# EAGLE design droracer (EAGLE 9.6.2)
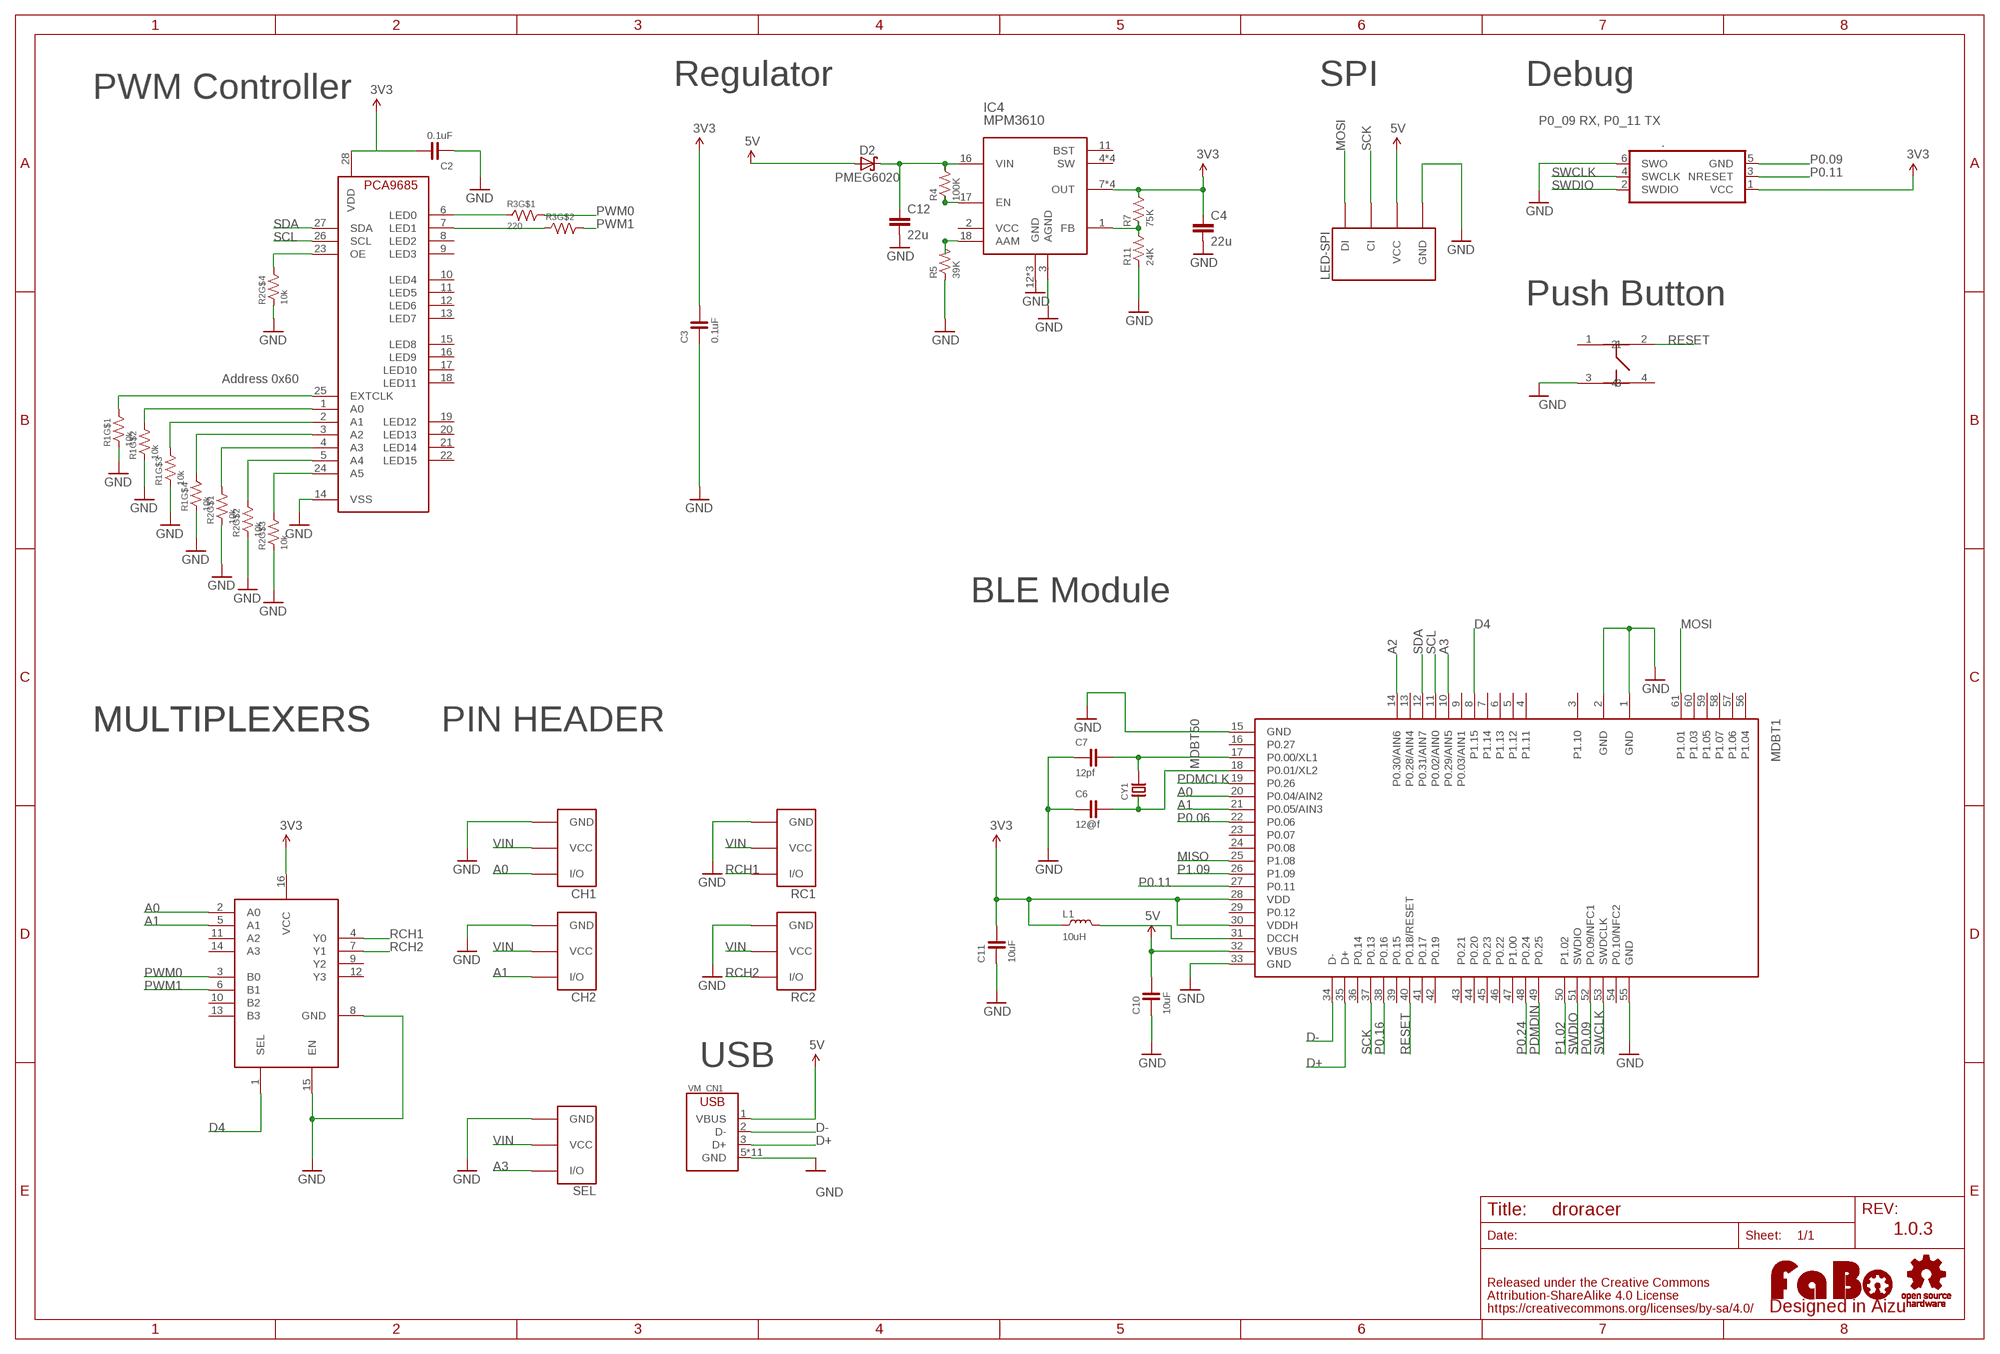
[diagram p0: schematic, sheet 1]

## Parts
.  TC2030-IDC-NL  [TC2030-IDC-NL]
C2  0.1uF  CAPACITOR-0603  [0603]
C3  0.1uF  CAPACITOR-0603  [0603]
C4  22u  C-22U-0805  [0805-R2013X50N]
C6  12@f  CAPACITOR-0603  [0603]
C7  12pf  CAPACITOR-0603  [0603]
C10  10uF  CAPACITOR-0603  [0603]
C11  10uF  CAPACITOR-0603  [0603]
C12  22u  C-22U-0805  [0805-R2013X50N]
CH1  FABO_BRICK_3PIN-HEADER  [FABO_BRICK_3PIN_HEADER]
CH2  FABO_BRICK_3PIN-HEADER  [FABO_BRICK_3PIN_HEADER]
CY1  CRYSTAL-ABS07  [ABRACON-ABS07-32.768KHZ]
D2  PMEG6020  PMEG6020AELRX  [SODFL3517X110N]
IC3  MULTIPLEXERSMC74HC157A  [TSSOP-16]
IC4  MPM3610  [MPM3610]
L1  10uH  COIL-0603  [0603]
LED-SPI  FABO-SPI-LED-B04B  [SPI-B04B-PASK-1]
MDBT1  MDBT50  [MDBT50]
R1  10k  RESISTOR_ARRAY  [EXBV8V]
R2  10k  RESISTOR_ARRAY  [EXBV8V]
R3  220  RESISTOR_ARRAY  [EXBV8V]
R4  100K  RESISTOR-0603  [0603]
R5  39K  RESISTOR-0603  [0603]
R7  75K  RESISTOR-0603  [0603]
R11  24K  RESISTOR-0603  [0603]
RC1  FABO_BRICK_3PIN-HEADER  [FABO_BRICK_3PIN_HEADER]
RC2  FABO_BRICK_3PIN-HEADER  [FABO_BRICK_3PIN_HEADER]
SEL  FABO_BRICK_3PIN-HEADER  [FABO_BRICK_3PIN_HEADER]
U$2  PCA9685  [PCA9685]
U$3  LOGO_OSHW-M_BOTTOM  [LOGO_OSHW_M_BOTTOM]
U$4  LOGO_FABO-M  [LOGO_FABO_MS]
U$5  SWICTH-4P(KMR2)  [SWITCH-4P(KMR2)]
VM_CN1  USB-ZX62D  [ZX62D-B-5PA8]

## Nets
3V3: ..1(VCC) C2.2 C3.2 C4.1 C11.2 IC3.16(VCC) IC4.7(OUT) IC4.8(OUT) IC4.9(OUT) IC4.20(OUT) L1.1 MDBT1.28(VDD) MDBT1.30(VDDH) R7.2 U$2.28(VDD)
5V: C10.2 D2.A LED-SPI.VCC MDBT1.32(VBUS) VM_CN1.1(VBUS)
A0: CH1.I/O IC3.2(A0) MDBT1.20(P0.04/AIN2)
A1: CH2.I/O IC3.5(A1) MDBT1.21(P0.05/AIN3)
A2: MDBT1.14(P0.30/AIN6)
A3: MDBT1.10(P0.29/AIN5) SEL.I/O
D4: IC3.1(SEL) MDBT1.8(P1.15)
D+: MDBT1.35(D+) VM_CN1.3(D+)
D-: MDBT1.34(D-) VM_CN1.2(D-)
FB: IC4.1(FB) R7.1 R11.2
GND: ..6(SWO) C2.1 C3.1 C4.2 C6.1 C7.1 C10.1 C11.1 C12.2 CH1.GND CH2.GND IC3.8(GND) IC3.15(EN) IC4.3(AGND) IC4.12(GND) IC4.13(GND) IC4.14(GND) LED-SPI.GND MDBT1.1(GND) MDBT1.2(GND) MDBT1.15(GND) MDBT1.33(GND) MDBT1.55(GND) R1.1 R1.2 R1.3 R1.4 R2.1 R2.2 R2.3 R2.4 R5.1 R11.1 RC1.GND RC2.GND SEL.GND U$2.14(VSS) U$5.3 VM_CN1.5(GND) VM_CN1.B1(GND) VM_CN1.B2(GND) VM_CN1.B3(GND) VM_CN1.B4(GND) VM_CN1.T1(GND) VM_CN1.T2(GND) VM_CN1.T3(GND) VM_CN1.T4(GND) VM_CN1.T5(GND) VM_CN1.T6(GND)
MISO: MDBT1.25(P1.08)
MOSI: LED-SPI.DI MDBT1.61(P1.01)
N$2: R3.1 U$2.6(LED0)
N$3: R3.2 U$2.7(LED1)
N$4: IC4.17(EN) R4.1
N$5: C12.1 D2.C IC4.16(VIN) R4.2
N$6: IC4.18(AAM) R5.2
N$7: R2.5 U$2.23(OE)
N$8: R1.8 U$2.25(EXTCLK)
N$9: R1.7 U$2.1(A0)
N$10: R1.6 U$2.2(A1)
N$11: R1.5 U$2.3(A2)
N$12: R2.8 U$2.4(A3)
N$13: R2.7 U$2.5(A4)
N$19: R2.6 U$2.24(A5)
N$20: C7.2 CY1.P$2 MDBT1.17(P0.00/XL1)
N$21: C6.2 CY1.P$1 MDBT1.18(P0.01/XL2)
N$22: L1.2 MDBT1.31(DCCH)
P0.06: MDBT1.22(P0.06)
P0.09: ..5(GND) MDBT1.52(P0.09/NFC1)
P0.11: ..3(NRESET) MDBT1.27(P0.11)
P0.16: MDBT1.38(P0.16)
P0.24: MDBT1.48(P0.24)
P1.02: MDBT1.50(P1.02)
P1.09: MDBT1.26(P1.09)
PDMCLK: MDBT1.19(P0.26)
PDMDIN: MDBT1.49(P0.25)
PWM0: IC3.3(B0) R3.8
PWM1: IC3.6(B1) R3.7
RCH1: IC3.4(Y0) RC1.I/O
RCH2: IC3.7(Y1) RC2.I/O
RESET: MDBT1.40(P0.18/RESET) U$5.2
SCK: LED-SPI.CI MDBT1.37(P0.13)
SCL: MDBT1.11(P0.02/AIN0) U$2.26(SCL)
SDA: MDBT1.12(P0.31/AIN7) U$2.27(SDA)
SWCLK: ..4(SWCLK) MDBT1.53(SWDCLK)
SWDIO: ..2(SWDIO) MDBT1.51(SWDIO)
VIN: CH1.VCC CH2.VCC RC1.VCC RC2.VCC SEL.VCC
Unconnected: IC3.9(Y2) IC3.10(B2) IC3.11(A2) IC3.12(Y3) IC3.13(B3) IC3.14(A3) IC4.2(VCC) IC4.4(SW) IC4.5(SW) IC4.6(SW) IC4.11(BST) IC4.19(SW) MDBT1.3(P1.10) MDBT1.4(P1.11) MDBT1.5(P1.12) MDBT1.6(P1.13) MDBT1.7(P1.14) MDBT1.9(P0.03/AIN1) MDBT1.13(P0.28/AIN4) MDBT1.16(P0.27) MDBT1.23(P0.07) MDBT1.24(P0.08) MDBT1.29(P0.12) MDBT1.36(P0.14) MDBT1.39(P0.15) MDBT1.41(P0.17) MDBT1.42(P0.19) MDBT1.43(P0.21) MDBT1.44(P0.20) MDBT1.45(P0.23) MDBT1.46(P0.22) MDBT1.47(P1.00) MDBT1.54(P0.10/NFC2) MDBT1.56(P1.04) MDBT1.57(P1.06) MDBT1.58(P1.07) MDBT1.59(P1.05) MDBT1.60(P1.03) R3.3 R3.4 R3.5 R3.6 U$2.8(LED2) U$2.9(LED3) U$2.10(LED4) U$2.11(LED5) U$2.12(LED6) U$2.13(LED7) U$2.15(LED8) U$2.16(LED9) U$2.17(LED10) U$2.18(LED11) U$2.19(LED12) U$2.20(LED13) U$2.21(LED14) U$2.22(LED15) U$5.1 U$5.4

## Notes on the sheet
- Regulator | SPI | Debug
- PWM Controller
- P0_09 RX, P0_11 TX
- Push Button
- Address 0x60
- BLE Module
- MULTIPLEXERS | MULTIPLEXERS | PIN HEADER
- USB
- 1.0.3

## Library data of the parts
. = TagConnect:TC2030-IDC: Tag-Connect In Circuit Programming & Debug Cable 6 Pin http://www.tag-connect.com
C2 C3 C6 C7 C10 C11 = FaBo-Capacitor:CAPACITOR: CAPACITOR
C4 C12 = Arduino-rcl:C: SMD Capacitor; CODE-ARDUINO: 2233; DATASHEET: https://media.digikey.com/pdf/Data%20Sheets/Samsung%20PDFs/CL21A226MQCLQNC_character.pdf; DISTRIBUTOR-LINK: https://www.digikey.com/product-detail/en/samsung-electro-mechanics-america-inc/CL21A226MQCLQNC/1276-2412-1-ND/3890498; DISTRIBUTOR-PN: 1276-2412-1-ND; MANUFACTURER: Samsung; MANUFACTURER-PN: CL21A226MQCLQNC; NOTE: -
CH1 CH2 RC1 RC2 SEL = FaBo-Template:FABO_BRICK_3PIN: FaBo Brick 3pin
CY1 = FaBo-Crystal:CRYSTAL
D2 = Arduino-diodes:PMEG6020AELRX: 60 V, 2 A low leakage current Schottky barrier rectifier Datasheet <http://www.nxp.com/documents/data_sheet/PMEG6020AELR.pdf>; CODE-ARDUINO: 2208; DATASHEET: http://www.nxp.com/documents/data_sheet/PMEG6020AELR.pdf; DISTRIBUTOR-LINK: http://www.digikey.com/products/en?keywords=%20568-12710-1-ND; DISTRIBUTOR-PN: 568-12710-1-ND; MANUFACTURER: NXP; MANUFACTURER-PN: PMEG6020AELRX
IC3 = FaBo-Multiplexers:MULTIPLEXERS
IC4 = Arduino-ICs:MPM3610: MPM3610 Step Down Regulator; CODE-ARDUINO: 2093; DATASHEET: https://www.monolithicpower.com/pub/media/document/MPM3610_r1.01.pdf; DISTRIBUTOR-LINK: https://www.digikey.com/product-detail/en/monolithic-power-systems-inc/MPM3610AGQV-P/1589-1249-1-ND/5298336; DISTRIBUTOR-PN: 1589-1249-1-ND; MANUFACTURER: MPS; MANUFACTURER-PN: MPM3610AGQV-P; RESTRICTIONS: NO
L1 = FaBo-Coil:COIL: RESISTOR
LED-SPI = FaBo-Connetor:FABO-SPI-LED
MDBT1 = MDBT50Q_171031:MDBT50: Raytac Corporation MDBT50 Bluetooth Low Energy Module based on Noridc nRF52840 Source: Raytac datasheet
R1-R3 = component:RESISTOR_ARRAY
R4 R5 R7 R11 = FaBo-Resistors:RESISTOR: RESISTOR
U$2 = FaBo-Motor:PCA9685
U$3 = FaBo-Logo:LOGO_OSHW
U$4 = FaBo-Logo:LOGO_FABO
U$5 = gclue-test:SWICTH-4P(KMR2)
VM_CN1 = component:USB

## Net classes
2 gnd: width 0.254 mm, drill 0.61 mm, clearance 0.254 mm
3 usbvcc: width 0.254 mm, drill 0.61 mm, clearance 0.254 mm
4 aref: width 0.254 mm, drill 0.61 mm, clearance 0.254 mm

## Board
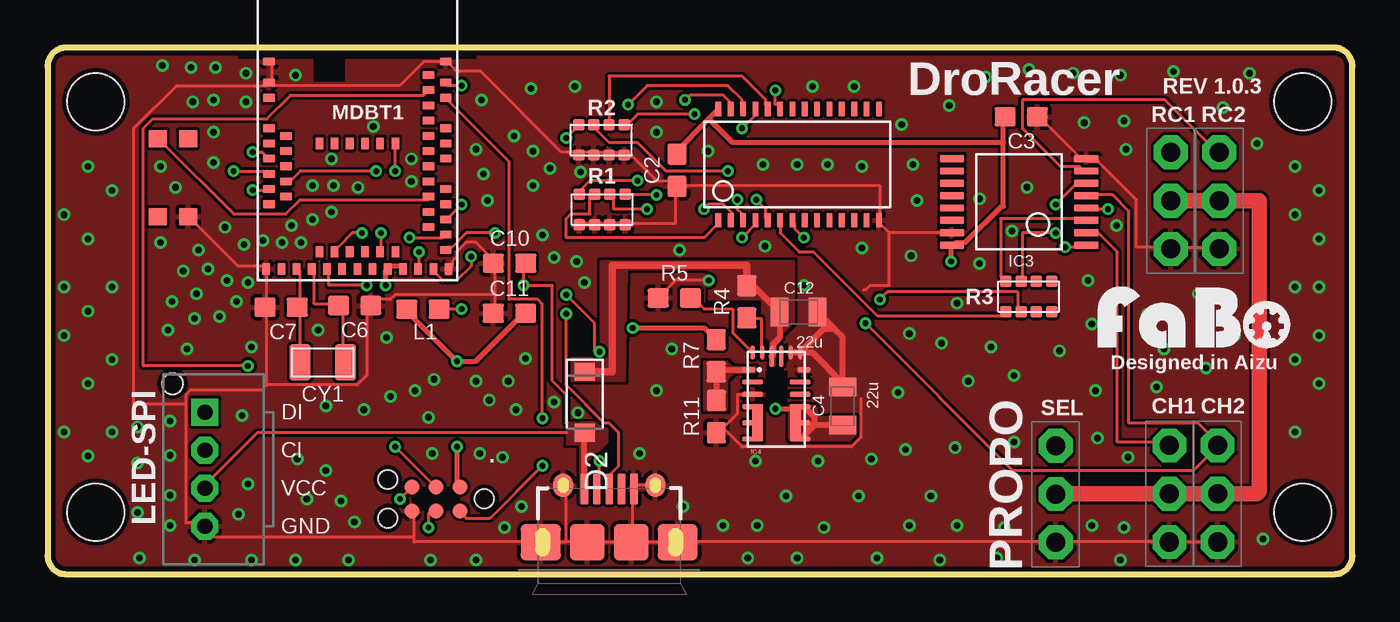
[diagram p1: board, top side]
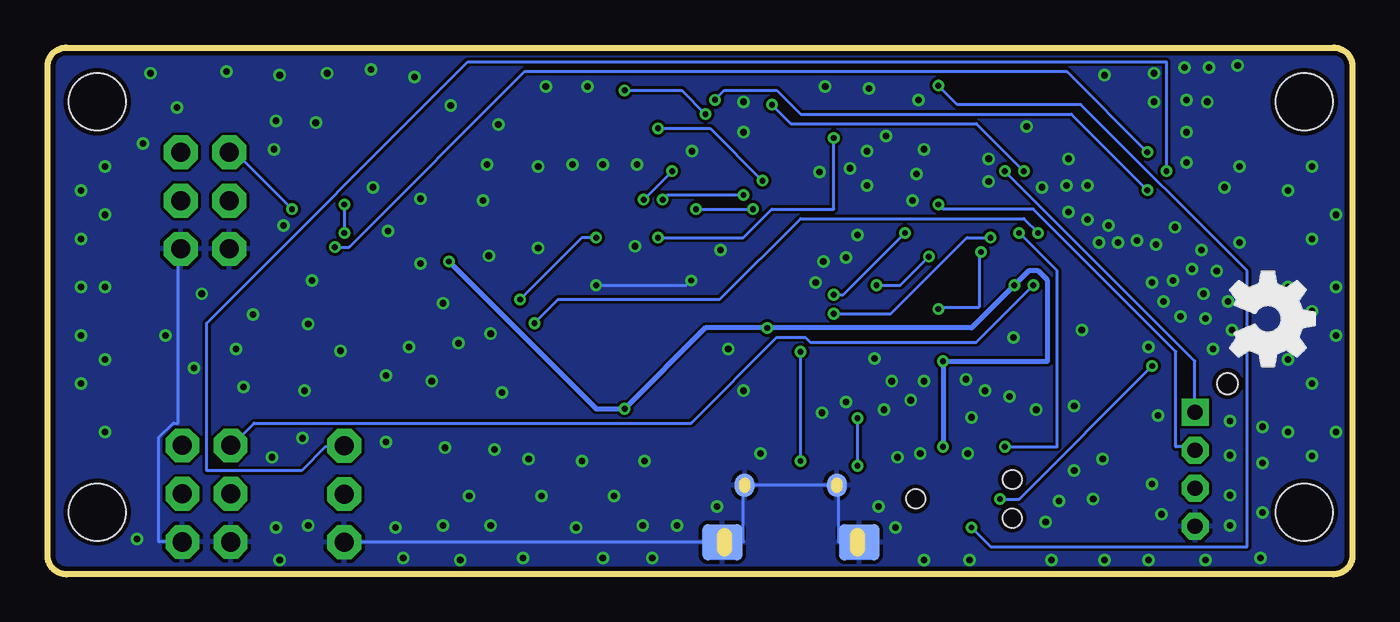
[diagram p2: board, bottom side, seen from below]

Size 68.66 x 27.71 mm. Coordinates in mm from the lower left corner, seen from the top.
Outline: 1,0 67.66,0 arc90 68.66,1 68.66,26.71 arc90 67.66,27.71 1,27.71 arc90 0,26.71 0,1 arc90 1,0
Copper layers (1*16): Top 0.035mm / dielectric 1.6mm / Bottom 0.035mm
Design rules "PCBway": minimum track width 6mil, minimum drill 12mil, track to track 6mil, track to pad 6mil, pad to pad 6mil, via to via 6mil, smd to smd 6mil, copper to edge 10mil, drill to drill 10mil, minimum pad ring 10mil, minimum via ring 6mil, stop-mask expansion 2mil, vias tented up to drill 100mil, thermal gap 8mil
Holes 3 mm at 2.54,24.86 2.54,3.27 66.04,3.27 66.04,24.86

### Footprints (pad centres in the part's own frame; a part is rotated, then mirrored left to right if it is on the bottom)
TC2030-IDC-NL = smd 0.787 x 0.787: 1 -1.27,-0.635; 2 -1.27,0.635; 3 0,-0.635; 4 0,0.635; 5 1.27,-0.635; 6 1.27,0.635 | hole 0.991: -2.54,0; 2.54,1.016; 2.54,-1.016
0603 = smd 1.1 x 1: 1 -0.85,0; 2 0.85,0
0805-R2013X50N = smd 0.95 x 1.45: 1 -1,0; 2 1,0
FABO_BRICK_3PIN_HEADER = drill 1 pad 1.778 octagon: GND -2.54,0; I/O 2.54,0; VCC 0,0
ABRACON-ABS07-32.768KHZ = smd 1.1 x 1.9: P$1 -1.2,0; P$2 1.2,0
SODFL3517X110N = smd 0.91 x 1.07: A 1.605,0; C -1.605,0
TSSOP-16 = smd 0.36 x 1.26: 1 -2.275,-3.53; 2 -1.625,-3.53; 3 -0.975,-3.53; 4 -0.325,-3.53; 5 0.325,-3.53; 6 0.975,-3.53; 7 1.625,-3.53; 8 2.275,-3.53; 9 2.275,3.53; 10 1.625,3.53; 11 0.975,3.53; 12 0.325,3.53; 13 -0.325,3.53; 14 -0.975,3.53; 15 -1.625,3.53; 16 -2.275,3.53
MPM3610 = smd 0.7 x 0.25: 1 -1.45,1.55; 4 -1.45,-0.4; 5 -1.45,-1.25; 6 -1.45,-2.1; 7 1.45,-2.1; 8 1.45,-1.25; 9 1.45,-0.4; 12 1.45,1.55 | smd 1.1 x 0.25: 2 -1.25,0.9; 3 -1.25,0.25; 10 1.25,0.25; 11 1.25,0.9 | smd 0.25 x 0.7: 13 1.25,2.45; 14 0.75,2.45; 17 -0.75,2.45; 18 -1.25,2.45 | smd 0.25 x 1.1: 15 0.25,2.25; 16 -0.25,2.25 | smd 0.6 x 1.95: 19 -1,-1.25; 20 1,-1.25
SPI-B04B-PASK-1 = drill 0.8 pad 1.422 octagon: CI 1,1.27; GND -3,1.27; VCC -1,1.27 | drill 0.8 pad 1.422 square: DI 3,1.27 | hole 1.1: 4.5,2.97
MDBT50 = smd 0.6 x 0.4: 1 -4.65,3.75; 2 -4.65,2.65; 3 -4.65,1.85; 4 -4.65,0.25; 5 -3.75,-0.15; 6 -4.65,-0.55; 7 -3.75,-0.95; 8 -4.65,-1.35; 9 -3.75,-1.75; 10 -4.65,-2.15; 11 -3.75,-2.55; 12 -4.65,-2.95; 13 -3.75,-3.35; 14 -4.65,-3.75; 34 4.65,-6.15; 35 4.65,-5.35; 36 3.75,-4.95; 37 4.65,-4.55; 38 3.75,-4.15; 39 4.65,-3.75; 40 3.75,-3.35; 41 4.65,-2.95; 42 3.75,-2.55; 43 3.75,-1.75; 44 4.65,-1.35; 45 3.75,-0.95; 46 4.65,-0.55; 47 3.75,-0.15; 48 4.65,0.25; 49 3.75,0.65; 50 3.75,1.45; 51 4.65,1.85; 52 3.75,2.25; 53 4.65,2.65; 54 3.75,3.05; 55 4.65,3.75 | smd 0.4 x 0.6: 15 -4.8,-7.15; 16 -4,-7.15; 17 -3.2,-7.15; 18 -2.4,-7.15; 19 -2,-6.25; 20 -1.6,-7.15; 21 -1.2,-6.25; 22 -0.8,-7.15; 23 -0.4,-6.25; 24 0,-7.15; 25 0.4,-6.25; 26 0.8,-7.15; 27 1.2,-6.25; 28 1.6,-7.15; 29 2,-6.25; 30 2.4,-7.15; 31 3.2,-7.15; 32 4,-7.15; 33 4.8,-7.15; 56 -2,-0.55; 57 -1.2,-0.55; 58 -0.4,-0.55; 59 0.4,-0.55; 60 1.2,-0.55; 61 2,-0.55
EXBV8V = smd 0.6 x 0.6: 1 -1.2,-0.8; 2 -0.4,-0.8; 3 0.4,-0.8; 4 1.2,-0.8; 5 1.2,0.8; 6 0.4,0.8; 7 -0.4,0.8; 8 -1.2,0.8
PCA9685 = smd 0.3 x 0.75: 1 -4.15,-2.93; 2 -3.5,-2.93; 3 -2.85,-2.93; 4 -2.2,-2.93; 5 -1.55,-2.93; 6 -0.9,-2.93; 7 -0.25,-2.93; 8 0.4,-2.93; 9 1.05,-2.93; 10 1.7,-2.93; 11 2.35,-2.93; 12 3,-2.93; 13 3.65,-2.93; 14 4.3,-2.93; 15 4.3,2.92; 16 3.65,2.92; 17 3,2.92; 18 2.35,2.92; 19 1.7,2.92; 20 1.05,2.92; 21 0.4,2.92; 22 -0.25,2.92; 23 -0.9,2.92; 24 -1.55,2.92; 25 -2.2,2.92; 26 -2.85,2.92; 27 -3.5,2.92; 28 -4.15,2.92
SWITCH-4P(KMR2) = smd 0.9 x 0.95: 1 -1,0; 2 3.1,0; 3 -1,-1.6; 4 3.1,-1.6
ZX62D-B-5PA8 = smd 0.4 x 1.6: 1 -1.3,4.25; 2 -0.65,4.25; 3 0,4.25; 4 0.65,4.25; 5 1.3,4.25 | smd 1.05 x 1.25 bottom: B1 -2.425,4.45; B2 2.425,4.45 | smd 2.1 x 1.9 bottom: B3 -3.6,1.45; B4 3.6,1.45 | smd 1.05 x 1.25: T1 -2.425,4.45; T2 2.425,4.45 | smd 2.1 x 1.9: T3 -3.6,1.45; T6 3.6,1.45 | smd 1.8 x 1.9: T4 -1.15,1.45; T5 1.15,1.45

### Placement (x,y rotation side)
.  20.44,3.97 180 top
C2  33.12,21.26 90 top
C3  51.23,24.07 180 top
C4  41.83,8.85 90 top
C6  16.16,14.14 180 top
C7  12.29,14.05 0 top
C10  24.31,16.37 0 top
C11  24.3,13.73 0 top
C12  39.52,13.8 0 top
CH1  59.02,4.24 90 top
CH2  61.55,4.24 90 top
CY1  14.48,11.15 180 top
D2  28.27,9.05 270 top
IC3  51.12,19.6 90 top
IC4  38.35,9.22 0 top
L1  19.75,13.95 0 top
LED-SPI  9.55,5.53 90 top
MDBT1  16.3,23.22 0 top
R1  29.19,19.2 0 top
R2  29.14,22.86 0 top
R3  51.62,14.61 0 top
R4  36.79,14.34 90 top
R5  32.98,14.54 0 top
R7  35.18,11.5 90 top
R11  35.19,8.3 90 top
RC1  59.09,19.66 90 top
RC2  61.65,19.66 90 top
SEL  53.04,4.22 90 top
U$2  39.44,21.56 0 top
U$3  4.45,13.43 90 top
U$4  60.32,11.52 0 top
U$5  5.8,19.82 90 top
VM_CN1  29.55,0.24 0 top

### Tracks (layer width: path | path; a pad name or v marks a point on that pad's centre or on a via)
3V3  (via drill 0.3)
  Top 0.152: 35.29,24.46 U$2.28 | 33.04,22.21 C2.2 | 50.29,23.96 C3.2 | 47.79,17.46 IC3.16 47.54,17.21 | 18.04,16.21 MDBT1.28 17.79,15.96 | 18.54,16.21 MDBT1.30 | 21.54,4.71 ..1 | 19.04,13.71 L1.1 | 35.04,12.46 R7.2 | 25.04,13.71 C11.2
  Top 0.254: 33.04,22.21 34.79,23.96 | 34.79,23.96 35.29,24.46 | 50.29,22.71 50.29,19.36 50.19,19.36 48.29,17.46 47.79,17.46 | 50.29,22.71 50.29,23.96 | 34.79,23.96 36.04,22.71 50.29,22.71 | 18.54,16.21 18.04,16.21 | v21.54,6.71 21.54,4.71 | 19.04,13.71 v21.54,11.21 22.54,11.21 25.04,13.71 | v17.79,15.21 17.79,15.96 | 35.04,12.46 34.54,12.96 v30.79,12.96 | v38.29,8.71 39.04,8.71 | v47.54,16.46 47.54,17.21
  Top 0.305: C4.1 40.34,7.85 | 40.34,7.85 39.92,7.85 IC4.8 | IC4.9 40.34,8.28 40.34,7.85 | IC4.7 39.8,7.31 40.34,7.85
  Bottom 0.254: v21.54,6.71 v21.54,11.21 16.04,11.21 16.04,15.46 16.54,15.96 17.04,15.96 v17.79,15.21 20.04,12.96 v30.79,12.96 34.04,12.96 v38.29,8.71 39.79,8.71 v47.54,16.46
  pour Top (no thermals): 39.04,8.86 40.34,8.86 40.44,8.76 40.44,8.26 43.54,8.26 43.64,8.36 43.64,7.06 39.14,7.06 39.04,7.16
5V  (via drill 0.3)
  Top 0.152: v22.29,16.71 22.29,16.21 21.54,15.46 20.79,15.46 20.29,15.96 MDBT1.32 | C10.2 25.04,16.21 v25.04,15.21 26.54,15.21 26.54,10.21 27.29,9.46 27.29,7.96 27.34,7.96 | 27.34,7.46 11.04,7.46 8.29,4.71 LED-SPI.VCC
  Top 0.305: VM_CN1.1 28.25,7.42 D2.A
  Bottom 0.152: v22.29,16.71 23.79,15.21 v25.04,15.21
  pour Top (no thermals): 28.34,5.86 29.44,6.96 29.44,7.96 27.34,7.96 27.34,6.86 28.04,6.86 28.04,3.76 28.34,4.66
A0  (via drill 0.3)
  Top 0.152: v16.79,15.21 14.79,15.21 14.79,15.96 MDBT1.20 | IC3.2 54.79,17.96 55.29,17.96 56.29,16.96 56.29,6.96 58.79,6.96 CH1.I/O
  Bottom 0.152: v16.79,15.21 19.79,12.21 28.54,12.21 28.79,12.46 30.29,12.46 34.79,7.96 57.79,7.96 58.79,6.96 CH1.I/O
A1  (via drill 0.3)
  Top 0.152: v16.54,17.96 16.04,17.96 15.29,17.21 MDBT1.21 | v43.04,13.21 50.79,5.46 60.29,5.46 61.54,6.71 CH2.I/O 61.54,6.96 60.54,7.96 56.89,7.96 56.89,19.11 56.04,19.96 54.79,19.96 IC3.5
  Bottom 0.152: v16.54,17.96 17.29,18.71 29.04,18.71 33.29,14.46 41.79,14.46 v43.04,13.21
A3  (via drill 0.3)
  Top 0.152: v9.79,21.21 11.54,21.21 MDBT1.10
  Bottom 0.152: v9.79,21.21 9.79,26.96 46.54,26.96 60.29,13.21 60.29,5.46 55.29,5.46 54.04,6.71 53.04,6.71 SEL.I/O
D4  (via drill 0.3)
  Top 0.152: v10.79,22.21 11.29,22.21 11.54,21.96 MDBT1.8 | v53.54,17.21 54.54,17.21 IC3.1
  Bottom 0.152: v10.79,22.21 15.04,26.46 43.54,26.46 52.79,17.21 v53.54,17.21
D+  (via drill 0.3)
  Top 0.152: v19.04,17.71 20.79,17.71 MDBT1.35 | v27.29,13.71 27.29,9.96 29.29,7.96 29.54,7.96 30.04,7.46 30.04,5.71 29.54,5.21 29.54,4.71 VM_CN1.3
  Bottom 0.152: v19.04,17.71 20.29,17.71 24.29,13.71 v27.29,13.71
D-  (via drill 0.3)
  Top 0.152: v23.54,17.96 22.04,17.96 21.29,17.21 21.04,17.21 MDBT1.34 | v27.29,14.71 28.79,13.21 28.79,11.71 v29.04,11.71 | v29.04,5.96 29.04,4.71 VM_CN1.2
  Bottom 0.152: v23.54,17.96 26.79,14.71 v27.29,14.71 | v29.04,5.96 v29.04,11.71
FB
  Top 0.305: R11.2 R7.1 35.3,10.77 IC4.1
  pour Top (no thermals): 37.24,10.86 36.04,10.86 35.74,11.16 34.54,11.16 34.54,8.66 35.74,8.66 35.74,10.26 36.14,10.66 37.24,10.66
GND  (via drill 0.3, 0.35)
  Top 0.152: 44.29,17.96 43.79,18.46 U$2.14 43.79,18.71 43.79,20.46 33.29,20.46 C2.1 | 44.29,17.96 47.54,17.96 IC3.15 | 35.54,7.71 36.29,8.46 36.29,9.46 37.04,9.46 IC4.3 | 35.54,7.71 35.29,7.46 R11.1 35.54,7.71 | v34.79,15.46 33.04,15.46 32.29,14.71 R5.1 | v39.79,15.21 39.84,15.16 | 35.54,7.71 36.54,6.71 42.29,6.71 42.79,7.21 42.79,9.26 | 44.29,17.96 44.29,15.21 43.29,15.21 43.04,14.96 42.94,14.96 | R1.1 28.04,18.46 28.54,18.46 R1.2 28.79,18.46 29.54,18.46 R1.3 29.79,18.46 30.29,18.46 R1.4 30.54,18.46 33.04,18.46 33.04,20.21 C2.1 | MDBT1.2 11.79,25.96 11.79,26.96 MDBT1.1 | 29.54,22.21 28.79,22.21 R2.2 28.54,22.21 28.04,22.21 R2.1 27.79,22.21 27.04,22.21 22.79,26.46 21.54,26.46 21.04,26.96 MDBT1.55 20.79,26.96 19.79,26.96 18.54,25.71 11.79,25.71 MDBT1.2 | 29.54,22.21 30.29,22.21 R2.4 30.54,21.96 30.79,21.96 32.04,20.71 32.79,20.71 33.04,20.46 C2.1 | 29.54,22.21 R2.3 | U$5.3 7.54,18.71 10.04,16.21 11.54,16.21 MDBT1.15 11.54,15.96 11.54,14.21 C7.1 11.54,13.96 11.54,9.96 | MDBT1.33 21.29,16.21 21.29,16.46 21.54,16.71 21.54,16.96 22.04,17.46 22.54,17.46 23.54,16.46 C10.1 23.54,16.21 23.54,14.71 | 23.54,14.71 23.54,13.96 C11.1 | 23.54,14.71 18.29,14.71 18.04,14.46 17.29,14.46 17.04,14.21 C6.1 16.79,13.96 16.79,10.46 16.29,9.96 11.54,9.96 | VM_CN1.B2 31.79,4.71 31.04,4.71 VM_CN1.5 30.79,4.46 30.79,1.71 | 30.79,1.71 33.04,1.71 VM_CN1.B4 33.29,1.71 53.04,1.71 | 30.79,1.71 VM_CN1.T5 30.54,1.71 28.54,1.71 VM_CN1.T4 28.29,1.71 27.29,1.71 | 27.29,1.71 27.29,4.46 VM_CN1.B1 | 19.29,1.96 19.29,1.71 25.79,1.71 VM_CN1.T3 26.04,1.71 27.29,1.71 | 19.29,1.96 19.29,3.21 ..6 | 19.29,1.96 8.79,1.96 8.29,2.46 LED-SPI.GND 8.04,2.71 7.29,2.71 7.29,8.96
  Top 0.152: 11.54,9.96 11.29,9.71 7.54,9.71 7.29,9.46 7.29,8.96 | C3.1 52.29,23.96 54.29,21.96 54.54,21.96 IC3.8 54.79,21.71 55.29,21.71 57.29,19.71 57.29,17.21 59.04,17.21 RC1.GND 59.29,17.21 61.54,17.21 RC2.GND | 53.04,1.71 58.79,1.71 CH1.GND 59.04,1.71 61.54,1.71 CH2.GND | 53.04,1.71 SEL.GND | 7.29,8.96 4.54,8.96 4.54,23.46 6.79,25.71 11.54,25.71 MDBT1.2
  Top 0.305: C4.2 41.83,10.06 | 41.83,10.06 41.83,12.49 41.4,12.92 | 41.4,12.92 C12.2 | IC4.14 IC4.13 | IC4.13 40.85,12.92 41.4,12.92 | IC4.13 40.22,11.67 41.83,10.06
  Bottom 0.152: v34.79,15.46 35.04,15.21 v39.79,15.21 | VM_CN1.T3 26.04,1.71 27.04,1.71 27.04,4.46 VM_CN1.B1 27.29,4.71 31.79,4.71 VM_CN1.B2 32.04,4.46 32.04,1.71 33.04,1.71 VM_CN1.B4 33.29,1.71 53.04,1.71 SEL.GND | RC2.GND 61.79,16.96 61.79,7.96 62.04,7.96 62.79,7.21 62.79,1.71 61.79,1.71 CH2.GND
  other vias: 22.94,21.06 25.54,22.26 10.44,26.36 8.84,26.66 8.74,24.96 13.04,26.26 7.54,26.66 7.64,24.86 6.04,26.76 10.44,24.86 25.44,25.56 22.84,24.96 15.04,20.46 13.94,18.66 12.34,17.46 11.34,17.56 10.34,17.36 10.54,15.36 9.44,15.46 9.94,14.36 9.34,18.26 16.34,20.36 22.54,22.36 24.54,23.06 25.54,20.46 23.14,19.66 19.14,20.66 19.14,21.86 17.14,23.56 14.94,21.86 13.94,20.46 13.34,17.46 12.84,18.36 7.94,17.06 8.44,16.06 9.04,13.56 7.84,14.76 7.14,15.96 6.74,20.36 5.94,21.46 8.74,21.66 8.74,23.26 6.54,14.36 7.74,13.46 7.34,11.86 6.34,12.86 10.74,11.96 14.24,12.86 17.84,12.46 19.34,9.66 18.04,9.36 14.64,8.86 10.24,8.36 10.54,4.76 14.64,5.46 15.44,3.86 23.94,6.16 20.24,6.36 24.94,3.56 45.14,6.56 40.84,2.46 40.54,5.96 32.84,11.86 32.04,9.66 27.84,16.46 33.24,17.06 26.04,17.86 40.24,25.66 42.44,25.66 45.54,21.56 47.44,24.66 42.84,21.46 41.04,21.56 39.44,21.56 37.64,21.56 51.64,26.56 56.44,26.26 53.94,26.36 59.24,26.46 63.24,26.36 63.64,22.66 61.84,24.56 56.64,23.86 54.54,23.76 56.74,22.36 54.74,15.46 57.84,13.66 60.54,14.76 58.34,9.86 55.14,9.66 53.24,11.76 49.64,11.96 50.84,10.46 47.04,12.16 48.44,10.16 49.04,16.36 45.44,16.76 45.74,19.66 49.04,19.76 51.54,20.36 42.84,17.16 44.74,9.56 50.84,6.96 56.84,6.16 56.64,2.46 56.44,0.76 47.84,2.56 45.34,2.56 46.94,0.76 43.64,0.86 39.44,0.86 36.84,0.86 37.34,2.56 31.14,6.36 37.24,5.96 24.24,10.16 23.24,9.16 20.04,8.26 28.24,15.36 32.04,23.26 28.04,21.16 27.74,25.66 34.74,22.26 44.94,23.66 55.24,7.16 47.74,6.66 43.34,6.06 50.34,2.46 63.94,1.86 58.74,11.86 54.94,13.16 25.14,11.36 24.64,8.66 4.84,0.86 4.74,3.26 4.74,5.86 6.44,6.26 6.44,4.16 5.94,17.46 26.44,21.36 26.64,16.66 49.34,26.16 62.44,12.56 60.94,10.86 54.94,2.56 49.94,0.86 35.54,2.56 33.44,3.56 22.54,0.76 20.14,0.76 16.14,2.76 22.74,6.36 22.54,10.16 20.34,10.26 16.64,8.66 15.84,0.76 24.04,2.46 45.34,12.66 37.74,17.26 14.94,19.06 13.14,6.06 13.64,3.96 10.04,3.16 13.04,0.76 10.74,0.76 7.74,0.76 6.44,2.56 6.44,8.06 4.74,7.76 26.64,9.06 56.24,18.36 50.74,18.06 47.84,14.26 2.13,21.46 2.13,17.65 2.13,13.84 2.13,10.03 2.13,6.22 65.63,21.46 65.63,18.92 65.63,15.11 65.63,11.3 65.63,7.49 46.47,4.12 42.66,4.12 38.85,4.12 66.9,17.65 66.9,20.19 66.9,12.57 66.9,10.03 3.4,20.19 3.4,15.11 3.4,11.3 3.4,7.49 0.86,7.49 0.86,12.57 0.86,15.11 0.86,18.92 66.9,15.11 27.91,8.5 32.04,24.86
  pour Top (no thermals): 39.04,11.26 39.44,11.26 39.44,10.66 40.54,10.66 40.84,10.36 40.84,9.26 42.94,9.26 42.94,15.06 42.64,15.06 39.84,15.16 39.84,12.26 39.04,12.26
  pour Top (rank 2): -0.4,-0.54 68.58,-0.54 68.58,28.67 -0.4,28.67
  pour Bottom (rank 2): -0.5,-0.54 68.58,-0.54 68.58,28.67 -0.5,28.67
MOSI  (via drill 0.3)
  Top 0.152: v18.29,21.21 18.29,22.46 MDBT1.61
  Bottom 0.152: v18.29,21.21 8.29,11.21 8.29,8.71 LED-SPI.DI
N$2
  Top 0.152: U$2.6 38.54,17.96 39.54,16.96 40.29,16.96 43.64,13.61 50.16,13.61 R3.1
N$3  (via drill 0.3)
  Top 0.152: v43.79,14.46 44.19,14.86 51.04,14.86 51.04,13.96 R3.2 | v39.79,17.71 39.29,18.21 39.29,18.46 U$2.7
  Bottom 0.152: v43.79,14.46 40.54,17.71 v39.79,17.71
N$4
  Top 0.152: IC4.17 37.54,11.71 37.54,13.46 36.79,13.46 R4.1
N$5
  Top 0.305: R4.2 37.13,15.19 C12.1 38.52,12.45 38.17,12.1 38.17,11.54 IC4.16
  Top 0.406: R4.2 36.79,16.26 29.7,16.26 29.7,10.66 D2.C
  pour Top (no thermals): 27.34,10.17 27.34,11.36 29.04,11.36 29.14,11.46 29.14,16.46 39.24,16.46 39.24,13.26 38.24,12.26 38.24,10.96 38.04,10.96 38.04,12.26 37.64,12.66 37.64,14.46 34.84,14.46 34.84,16.06 30.44,16.06 30.34,10.16
N$6
  Top 0.152: IC4.18 37.04,11.71 36.04,12.71 36.04,13.96 34.54,13.96 34.04,14.46 R5.2
N$7  (via drill 0.3)
  Top 0.152: v34.04,24.21 31.04,24.21 30.54,23.71 R2.5 | v38.29,25.46 38.29,24.71 38.54,24.71 U$2.23
  Bottom 0.152: v34.04,24.21 35.29,25.46 v38.29,25.46
N$8  (via drill 0.3)
  Top 0.152: v31.04,20.71 28.54,20.71 28.04,20.21 R1.8 | v36.54,23.46 37.29,24.21 37.29,24.46 U$2.25
  Bottom 0.152: v31.04,20.71 33.79,23.46 v36.54,23.46
N$9
  Top 0.152: R1.7 28.54,19.96 28.54,18.96 27.54,18.96 27.29,18.71 27.29,17.71 34.54,17.71 35.29,18.46 U$2.1
N$10  (via drill 0.3)
  Top 0.152: v31.54,19.21 29.79,19.21 29.79,19.96 R1.6 | v34.54,19.21 34.79,19.46 35.54,19.46 36.04,18.96 36.04,18.71 U$2.2
  Bottom 0.152: v34.54,19.21 v31.54,19.21
N$11  (via drill 0.3)
  Top 0.152: v32.04,19.96 30.54,19.96 R1.5 | v36.29,19.71 36.29,19.21 36.54,18.96 36.54,18.71 U$2.3
  Bottom 0.152: v32.04,19.96 36.04,19.96 v36.29,19.71
N$12  (via drill 0.3)
  Top 0.152: v27.29,22.96 27.79,23.46 R2.8 | v36.54,17.71 37.29,18.46 U$2.4
  Bottom 0.152: v27.29,22.96 27.29,19.21 30.54,19.21 32.04,17.71 v36.54,17.71
N$13  (via drill 0.3)
  Top 0.152: v35.79,21.21 32.54,21.21 31.04,22.71 29.54,22.71 28.79,23.46 R2.7 | v37.29,19.71 37.79,19.21 37.79,18.71 U$2.5
  Bottom 0.152: v37.29,19.71 v35.79,21.21
N$19
  Top 0.152: R2.6 29.54,26.21 36.54,26.21 37.79,24.96 37.79,24.71 U$2.24
N$20
  Top 0.152: MDBT1.17 13.29,15.96 13.29,14.21 C7.2 13.29,13.96 13.29,11.21 CY1.P$2
N$21
  Top 0.152: MDBT1.18 14.04,15.96 14.04,14.21 15.29,14.21 C6.2 15.54,13.96 15.54,11.21 CY1.P$1
N$22  (via drill 0.3)
  Top 0.152: v19.54,16.96 19.54,16.21 MDBT1.31 | v21.79,13.96 20.79,13.96 L1.2
  Bottom 0.152: v19.54,16.96 19.64,16.86 19.64,14.06 21.69,14.06 v21.79,13.96
P0.09  (via drill 0.3)
  Top 0.152: MDBT1.52 19.79,25.21 12.79,25.21 11.54,23.96 5.54,23.96 5.04,23.46 5.04,10.96 v10.54,10.96 | v18.54,3.96 19.04,4.46 ..5
  Bottom 0.152: v10.54,10.96 17.54,3.96 v18.54,3.96
P0.11  (via drill 0.3)
  Top 0.152: v17.54,17.96 17.54,17.21 MDBT1.27 | v18.29,6.71 20.29,4.71 ..3
  Bottom 0.152: v17.54,17.96 15.54,15.96 15.54,6.71 v18.29,6.71
PWM0
  Top 0.152: R3.8 50.14,15.7 50.14,18.71 54.54,18.71 IC3.3
PWM1  (via drill 0.3)
  Top 0.152: v53.04,17.96 51.29,17.96 51.29,15.46 R3.7 | v53.04,19.46 54.04,20.46 54.54,20.46 IC3.6
  Bottom 0.152: v53.04,19.46 v53.04,17.96
RCH1  (via drill 0.3)
  Top 0.152: v55.79,19.21 54.79,19.21 IC3.4
  Bottom 0.152: v55.79,19.21 58.54,21.96 59.04,21.96 RC1.I/O
RCH2
  Top 0.152: IC3.7 54.54,21.21 54.29,21.46 53.29,21.46 51.29,23.46 51.29,24.96 58.79,24.96 61.54,22.21 RC2.I/O
RESET
  Top 0.152: MDBT1.40 20.04,19.71 13.29,19.71 12.54,18.96 9.79,18.96 6.04,22.71 U$5.2
SCK  (via drill 0.3)
  Top 0.152: v21.79,19.46 21.04,18.71 MDBT1.37
  Bottom 0.152: v21.79,19.46 21.54,19.21 16.79,19.21 9.29,11.71 9.29,6.71 8.29,6.71 LED-SPI.CI
SCL  (via drill 0.3)
  Top 0.152: v17.29,21.21 13.29,21.21 12.79,20.71 MDBT1.11 | v30.54,24.71 31.54,25.71 35.79,25.71 36.54,24.96 36.54,24.71 U$2.26
  Bottom 0.152: v17.29,21.21 19.79,23.71 29.54,23.71 v30.54,24.71
SDA  (via drill 0.3)
  Top 0.152: v10.79,20.21 11.54,20.21 MDBT1.12 | v33.54,24.96 33.79,25.21 35.54,25.21 36.04,24.71 U$2.27
  Bottom 0.152: v10.79,20.21 14.79,24.21 29.04,24.21 30.29,25.46 33.04,25.46 v33.54,24.96
SWCLK  (via drill 0.3)
  Top 0.152: v21.79,25.71 21.04,25.71 MDBT1.53 | v20.04,2.46 20.04,3.21 20.29,3.21 ..4
  Bottom 0.152: v21.79,25.71 20.79,24.71 14.29,24.71 5.54,15.96 5.54,1.46 19.04,1.46 v20.04,2.46
SWDIO  (via drill 0.3)
  Top 0.152: v26.04,8.21 26.04,14.21 25.79,14.46 24.29,14.46 24.29,21.71 21.04,24.96 MDBT1.51 | v26.04,5.71 23.29,2.96 22.04,2.96 21.79,3.21 ..2
  Bottom 0.152: v26.04,5.71 v26.04,8.21
VIN
  Top 0.813: SEL.VCC 53.06,4.24 CH1.VCC CH2.VCC 63.62,4.24 63.74,4.36 63.74,19.66 RC2.VCC RC1.VCC

### Text on the board
tPlace: REV 1.0.3 | DroRacer | Designed in Aizu | PROPO